# Altium schematic sheet Power_Distribution.SchDoc
size A
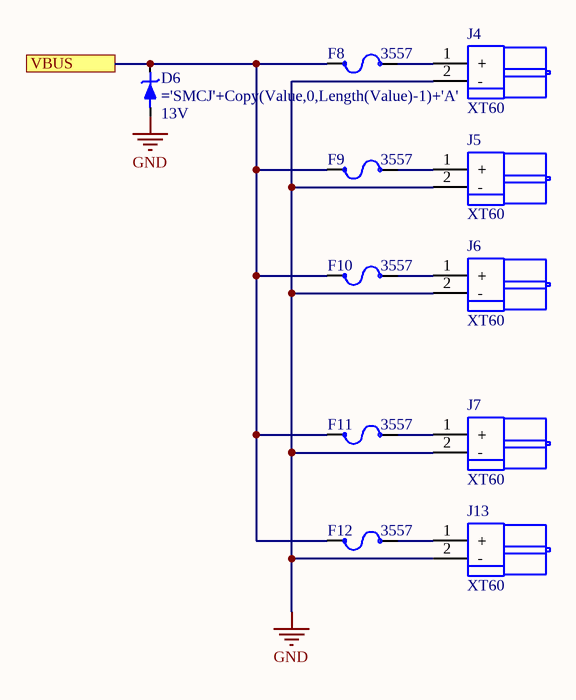
[diagram p0: Power_Distribution.SchDoc]

## Parts
D6  value 13V  [SMC]  (hidden comment: TVS Diode)
F8  3557  [F_3557_Mini]
F9  3557  [F_3557_Mini]
F10  3557  [F_3557_Mini]
F11  3557  [F_3557_Mini]
F12  3557  [F_3557_Mini]
J4  XT60  [J_XT60_Thru_Female]
J5  XT60  [J_XT60_Thru_Female]
J6  XT60  [J_XT60_Thru_Female]
J7  XT60  [J_XT60_SMD_Female]
J13  XT60  [J_XT60_SMD_Female]

## Ports
VBUS

## Nets
GND: D6.1(Anode) J4.2(-) J5.2(-) J6.2(-) J7.2(-) J13.2(-)
VBUS: D6.2(Cathode) F8.1 F9.1 F10.1 F11.1 F12.1 ; port VBUS
NetF8_2: F8.2 J4.1(+)
NetF9_2: F9.2 J5.1(+)
NetF10_2: F10.2 J6.1(+)
NetF11_2: F11.2 J7.1(+)
NetF12_2: F12.2 J13.1(+)

## Library data of the parts
D6 = D_TVS_SMCJ_Uni_generic: SMC Unidirectional TVS Diode; Manufacturer: Vishay; Power - Peak Pulse: 1500W; Type: Zener; Power - Dissipation: 6.5W; Operating Temperature: -55°C ~ 150°C; HelpURL: http://www.vishay.com/docs/88394/smcj.pdf; Manufacturer PN: ='SMCJ'+Copy(Value,0,Length(Value)-1)+'A'
F8-F12 = F_3557_MINI_ATO: Manufacturer: Keystone Electronics; Material: Brass,Nickel; Body Material: Brass; Current Rating: 30A; Voltage Rating (AC): 500V; Number of Circuits: 1; Fuse Current: 20A; Supplier 1: Digi-Key; Manufacturer Part Number: 3557; Stock 1: 70386; Pricing 1: 1=0.2, 10=0.185, 50=0.145, 100=0.1282, 250=0.1134, 500=0.1085, 1000=0.0887, 2500=0.0813, 5000=0.0789 (USD); Mount: Through Hole,Vertical,PCB; Contact Plating: Nickel,Tin; Contact Material: Brass; Min Operating Temperature: -50°C; Max Operating Temperature: 145°C; Package Quantity: 1; Termination: PC Pin; Orientation: Vertical; Packaging: Bulk; Voltage: 500V; Length: 0.4inch; Height: 0.15inch; Depth: 4.7mm; Width: 0.185inch; REACH SVHC: No SVHC; Lead Free: Lead Free; ComponentLink1URL: https://datasheet.ciiva.com/16425/m60-2p39-16425699.pdf; ComponentLink1Description: https://datasheet.ciiva.com/16425/m60-2p39-16425699.pdf; ComponentLink2URL: https://datasheet.ciiva.com/22650/1686040-22650696.pdf; ComponentLink2Description: https://datasheet.ciiva.com/22650/1686040-22650696.pdf; Supplier Part Number 1: 3557K-ND
J4-J7 J13 = J_XT60: 60 Amp XT60 Connector